# EAGLE design ledcube4x4x4_control (EAGLE 6.5.0)
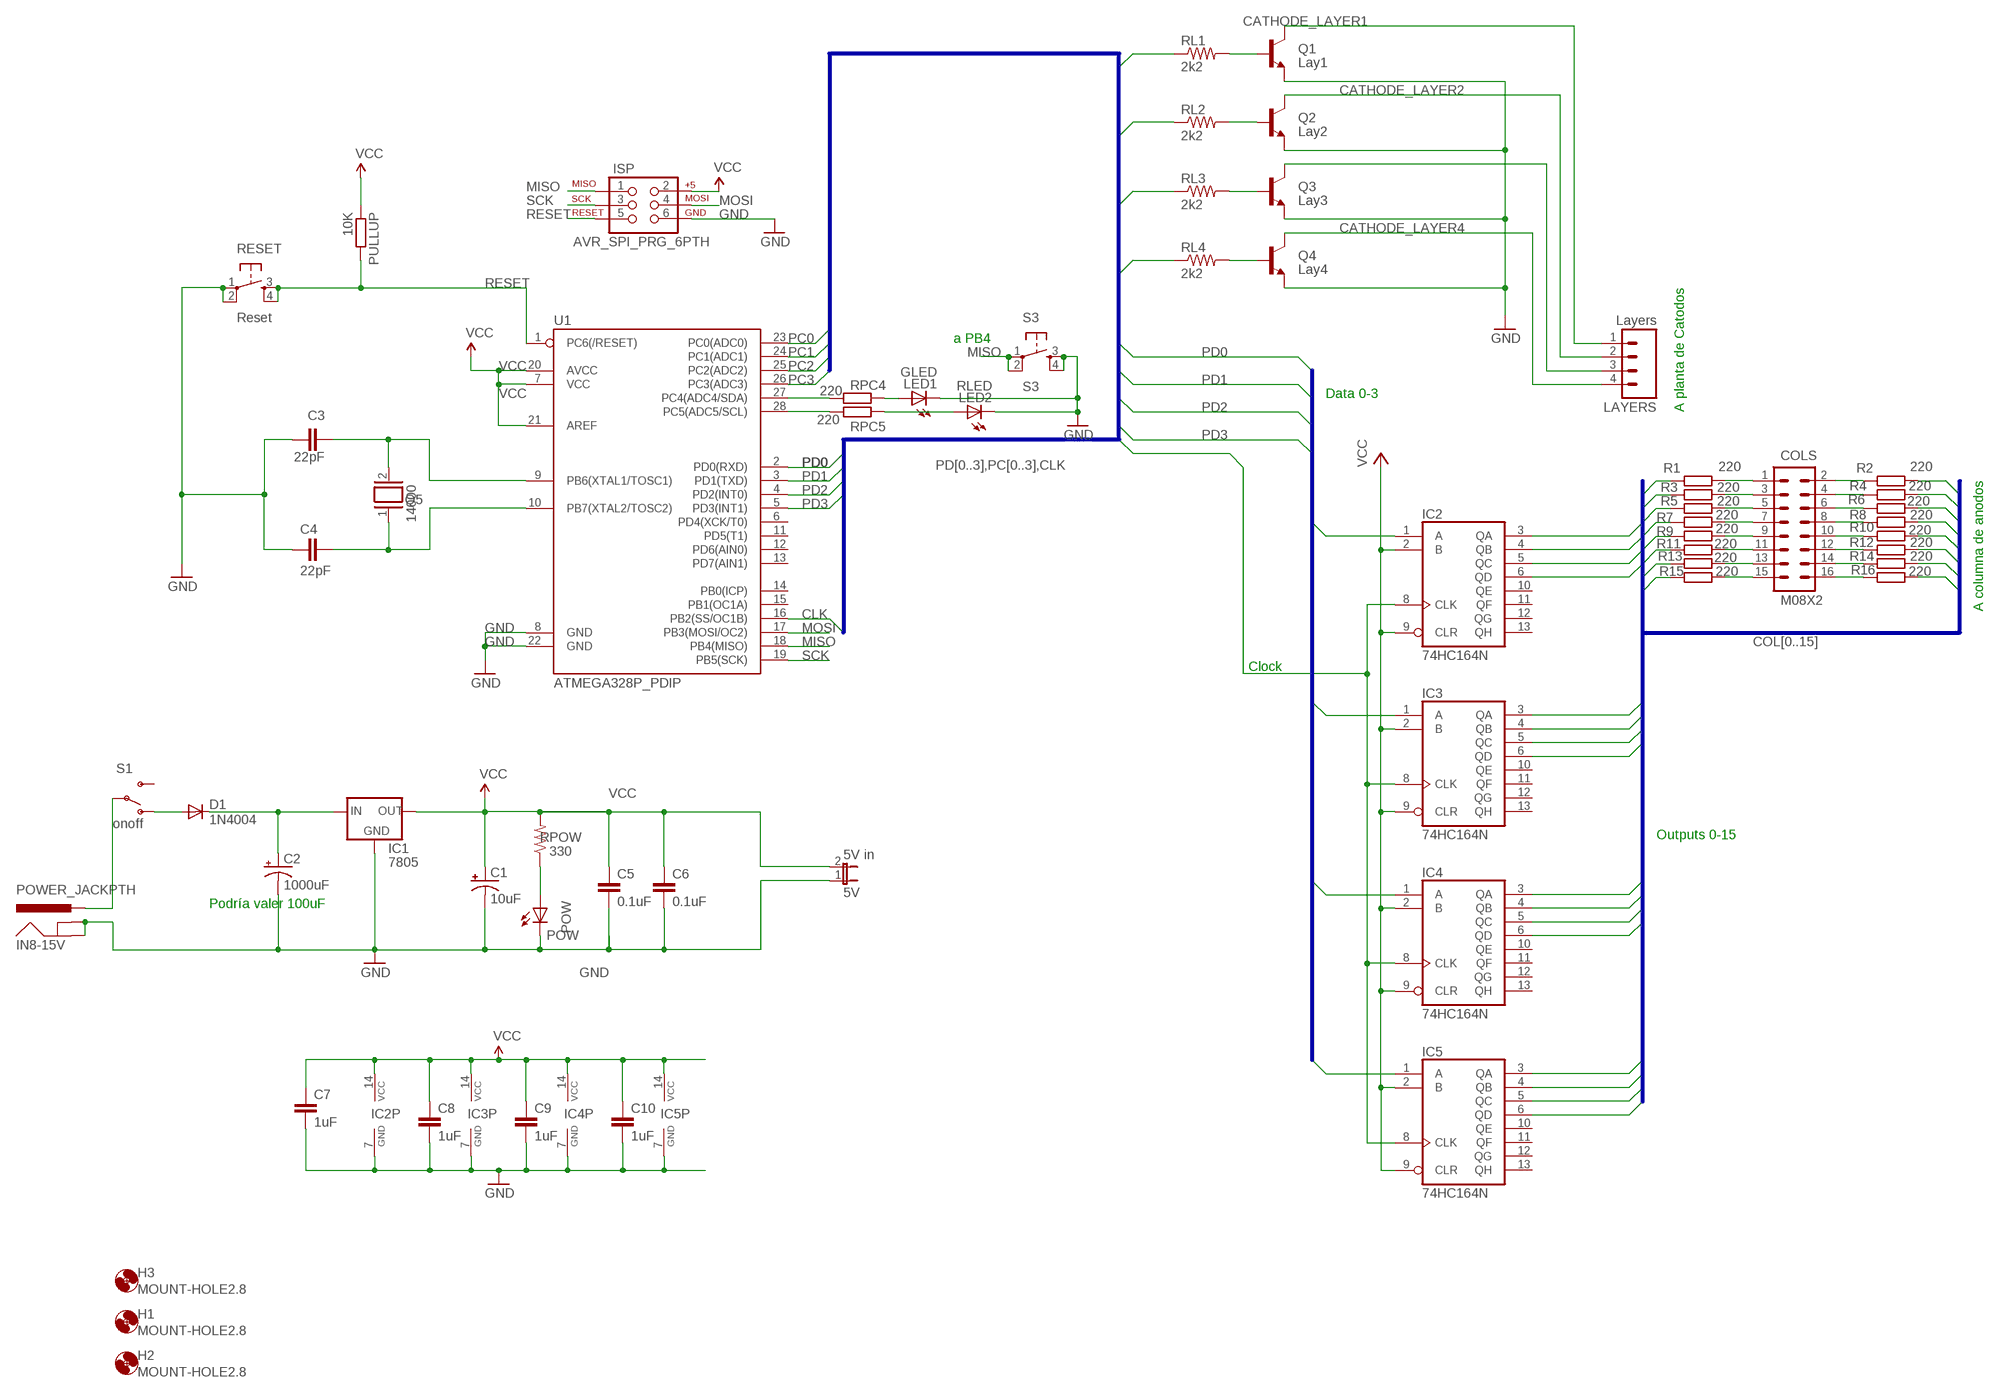
[diagram p0: schematic, sheet 1]

## Parts
5V  5V in  JP1E  [JP1]
C1  10uF  10UF-25V-20%(PTH)  [CPOL-RADIAL-10UF-25V]
C2  1000uF  CAP_POLPTH4  [CPOL-RADIAL-1000UF-25V]
C3  22pF  CAPEZ  [CAP-PTH-SMALLEZ]
C4  22pF  CAPEZ  [CAP-PTH-SMALLEZ]
C5  0.1uF  CAPKIT  [CAP-PTH-SMALL-KIT]
C6  0.1uF  CAPKIT  [CAP-PTH-SMALL-KIT]
C7  1uF  CAPKIT  [CAP-PTH-SMALL-KIT]
C8  1uF  CAPKIT  [CAP-PTH-SMALL-KIT]
C9  1uF  CAPKIT  [CAP-PTH-SMALL-KIT]
C10  1uF  CAPKIT  [CAP-PTH-SMALL-KIT]
COLS  M08X2  [2X8]
D1  1N4004  [DO41-10]
H1  MOUNT-HOLE2.8  [2,8]
H2  MOUNT-HOLE2.8  [2,8]
H3  MOUNT-HOLE2.8  [2,8]
IC1  7805  V_REG_78XXSINK  [TO220-IGO]
IC2  74HC164N  [DIL14]
IC3  74HC164N  [DIL14]
IC4  74HC164N  [DIL14]
IC5  74HC164N  [DIL14]
IN8-15V  POWER_JACKPTH  [POWER_JACK_PTH]
ISP  AVR_SPI_PRG_6PTH  [2X3]
LAYERS  Layers  M04PTH  [1X04]
LED1  GLED  LED5MM  [LED5MM]
LED2  RLED  LED5MM  [LED5MM]
POW  POW  LED3MM  [LED3MM]
PULLUP  10K  R-EU_0207/10  [0207/10]
Q1  Lay1  TRANSISTOR_NPNTO-92-AMMO  [TO-92-AMMO]
Q2  Lay2  TRANSISTOR_NPNTO-92-AMMO  [TO-92-AMMO]
Q3  Lay3  TRANSISTOR_NPNTO-92-AMMO  [TO-92-AMMO]
Q4  Lay4  TRANSISTOR_NPNTO-92-AMMO  [TO-92-AMMO]
Q5  14000  XTAL/S  [QS]
R1  220  R-EU_0207/10  [0207/10]
R2  220  R-EU_0207/10  [0207/10]
R3  220  R-EU_0207/10  [0207/10]
R4  220  R-EU_0207/10  [0207/10]
R5  220  R-EU_0207/10  [0207/10]
R6  220  R-EU_0207/10  [0207/10]
R7  220  R-EU_0207/10  [0207/10]
R8  220  R-EU_0207/10  [0207/10]
R9  220  R-EU_0207/10  [0207/10]
R10  220  R-EU_0207/10  [0207/10]
R11  220  R-EU_0207/10  [0207/10]
R12  220  R-EU_0207/10  [0207/10]
R13  220  R-EU_0207/10  [0207/10]
R14  220  R-EU_0207/10  [0207/10]
R15  220  R-EU_0207/10  [0207/10]
R16  220  R-EU_0207/10  [0207/10]
RESET  Reset  TAC_SWITCHPTH  [TACTILE-PTH]
RL1  2k2  RESISTORPTH-1/4W  [AXIAL-0.4]
RL2  2k2  RESISTORPTH-1/4W  [AXIAL-0.4]
RL3  2k2  RESISTORPTH-1/4W  [AXIAL-0.4]
RL4  2k2  RESISTORPTH-1/4W  [AXIAL-0.4]
RPC4  220  R-EU_0207/10  [0207/10]
RPC5  220  R-EU_0207/10  [0207/10]
RPOW  330  RESISTORPTH-1/4W  [AXIAL-0.4]
S1  onoff  SWITCH-SPDTPTH  [SWITCH-SPDT]
S3  S3  TAC_SWITCHPTH  [TACTILE-PTH]
U1  ATMEGA328P_PDIP  [DIL28-3]

## Nets
BASE_LAYER1: Q1.2(B) RL1.P$2
BASE_LAYER2: Q2.2(B) RL2.P$2
BASE_LAYER3: Q3.2(B) RL3.P$2
BASE_LAYER4: Q4.2(B) RL4.P$2
CATHODE_LAYER1: LAYERS.1 Q1.3(C)
CATHODE_LAYER2: LAYERS.2 Q2.3(C)
CATHODE_LAYER4: LAYERS.4 Q4.3(C)
CLK: IC2.8(CLK) IC3.8(CLK) IC4.8(CLK) IC5.8(CLK) U1.16(PB2(SS/OC1B))
COL0: IC2.3(QA) R1.1
COL1: IC2.4(QB) R2.2
COL2: IC2.5(QC) R3.1
COL3: IC2.6(QD) R4.2
COL4: IC3.3(QA) R5.1
COL5: IC3.4(QB) R6.2
COL6: IC3.5(QC) R7.1
COL7: IC3.6(QD) R8.2
COL8: IC4.3(QA) R9.1
COL9: IC4.4(QB) R10.2
COL10: IC4.5(QC) R11.1
COL11: IC4.6(QD) R12.2
COL12: IC5.3(QA) R13.1
COL13: IC5.4(QB) R14.2
COL14: IC5.5(QC) R15.1
COL15: IC5.6(QD) R16.2
GND: 5V.1 C1.2(-) C2.2(-) C3.2 C4.2 C5.2 C6.2 C7.2 C8.2 C9.2 C10.2 IC1.GND IC2.7(GND) IC3.7(GND) IC4.7(GND) IC5.7(GND) IN8-15V.GND IN8-15V.GNDBREAK ISP.6 LED1.K(C) LED2.K(C) POW.K(C) Q1.1(E) Q2.1(E) Q3.1(E) Q4.1(E) RESET.1 RESET.2 S3.3 S3.4 U1.8(GND) U1.22(GND)
MISO: ISP.1 S3.1 S3.2 U1.18(PB4(MISO))
MOSI: ISP.4 U1.17(PB3(MOSI/OC2))
N$1: IN8-15V.PWR S1.2(P)
N$2: C2.1(+) D1.C IC1.IN
N$3: LED2.A RPC5.2
N$4: LED1.A RPC4.2
N$5: RPC5.1 U1.28(PC5(ADC5/SCL))
N$7: RPC4.1 U1.27(PC4(ADC4/SDA))
N$9: COLS.1 R1.2
N$10: COLS.3 R3.2
N$11: LAYERS.3 Q3.3(C)
N$18: COLS.5 R5.2
N$19: C3.1 Q5.2 U1.9(PB6(XTAL1/TOSC1))
N$20: C4.1 Q5.1 U1.10(PB7(XTAL2/TOSC2))
N$21: COLS.7 R7.2
N$22: COLS.15 R15.2
N$23: COLS.13 R13.2
N$24: COLS.11 R11.2
N$25: COLS.9 R9.2
N$26: D1.A S1.1(O)
N$28: POW.A RPOW.P$1
N$36: COLS.2 R2.1
N$37: COLS.4 R4.1
N$38: COLS.6 R6.1
N$39: COLS.8 R8.1
N$40: COLS.10 R10.1
N$41: COLS.12 R12.1
N$42: COLS.14 R14.1
N$43: COLS.16 R16.1
PC0: RL1.P$1 U1.23(PC0(ADC0))
PC1: RL2.P$1 U1.24(PC1(ADC1))
PC2: RL3.P$1 U1.25(PC2(ADC2))
PC3: RL4.P$1 U1.26(PC3(ADC3))
PD0: IC2.1(A) U1.2(PD0(RXD))
PD1: IC3.1(A) U1.3(PD1(TXD))
PD2: IC4.1(A) U1.4(PD2(INT0))
PD3: IC5.1(A) U1.5(PD3(INT1))
RESET: ISP.5 PULLUP.2 RESET.3 RESET.4 U1.1(PC6(/RESET))
SCK: ISP.3 U1.19(PB5(SCK))
VCC [POWER]: 5V.2 C1.1(+) C5.1 C6.1 C7.1 C8.1 C9.1 C10.1 IC1.OUT IC2.2(B) IC2.9(CLR) IC2.14(VCC) IC3.2(B) IC3.9(CLR) IC3.14(VCC) IC4.2(B) IC4.9(CLR) IC4.14(VCC) IC5.2(B) IC5.9(CLR) IC5.14(VCC) ISP.2 PULLUP.1 RPOW.P$2 U1.7(VCC) U1.20(AVCC) U1.21(AREF)
Unconnected: IC2.10(QE) IC2.11(QF) IC2.12(QG) IC2.13(QH) IC3.10(QE) IC3.11(QF) IC3.12(QG) IC3.13(QH) IC4.10(QE) IC4.11(QF) IC4.12(QG) IC4.13(QH) IC5.10(QE) IC5.11(QF) IC5.12(QG) IC5.13(QH) S1.3(S) U1.6(PD4(XCK/T0)) U1.11(PD5(T1)) U1.12(PD6(AIN0)) U1.13(PD7(AIN1)) U1.14(PB0(ICP)) U1.15(PB1(OC1A))

## Buses
PD[0..3],PC[0..3],CLK
COL[0..15]
PD[0..3]

## Notes on the sheet
- a PB4
- Data 0-3
- A planta de Catodos
- A columna de anodos
- Clock
- Outputs 0-15
- Podría valer 100uF

## Library data of the parts
5V = jumper:JP1E: JUMPER; MF: TE CONNECTIVITY; MPN: 1-881545-1; OC_FARNELL: 1822174
C1 = SparkFun-Capacitors:10UF-25V-20%(PTH): CAP-08440; MF: RUBYCON; MPN: 100PK10MEFC5X11; OC_FARNELL: 2346533; PROD_ID: CAP-08440
C2 = SparkFun-Capacitors:CAP_POL: Capacitor Polarized These are standard SMD and PTH capacitors. Normally 10uF, 47uF, and 100uF in electrolytic and tantalum varieties. Always verify the external diameter of the through hole cap, it varies with capacity, voltage, and manufacturer. The EIA devices should be standard.; MF: RUBYCON; MPN: 35YXJ1000M12.5X20; OC_FARNELL: 2346262
C3-C10 = SparkFun-Capacitors:CAP: Capacitor Standard 0603 ceramic capacitor, and 0.1" leaded capacitor.; OC_FARNELL: unknown
COLS = SparkFun-Connectors:M08X2: .1" headers, two rows of 8 each; OC_FARNELL: unknown
D1 = diode:1N4004: DIODE general purpose rectifier, 1 A; MF: MICRO COMMERCIAL COMPONENTS; MPN: 1N4004-TP; OC_FARNELL: 1924514
H1-H3 = holes:MOUNT-HOLE: MOUNTING HOLE with drill center marker; OC_FARNELL: unknown
IC1 = SparkFun-PowerIC:V_REG_78XX: Voltage Regulator Standard 7805 5V regulator. IGO (Input Ground Output). Spark Fun Electronics SKU : COM-00107; MF: STMICROELECTRONICS; MPN: L7805ABV; OC_FARNELL: 1467758
IC2-IC5 = 74xx-eu:74*164: 8-bit parallel out SHIFT REGISTER; MF: TEXAS INSTRUMENTS; MPN: SN74HC164N; OC_FARNELL: 1287514
IN8-15V = SparkFun-Connectors:POWER_JACK: Power Jack This is the standard 5.5mm barrel jack for power. The PTH is the most common, proven, reliable, footprint. The Slot footprint only works if the mill layer is transmitted to the PCB fab house so be warned. Mating wall wart : TOL-00298 (and others); OC_FARNELL: unknown; PROD_ID: PRT-00119
ISP = SparkFun-Connectors:AVR_SPI_PRG_6: AVR ISP 6 Pin This is the reduced ISP connector for AVR programming. Common on Arduino. This footprint will take up less PCB space and can be used with a 10-pin to 6-pin adapter such as SKU: BOB-08508; OC_FARNELL: unknown
LAYERS = SparkFun-Connectors:M04: Header 4 Standard 4-pin 0.1" header. Use with straight break away headers (SKU : PRT-00116), right angle break away headers (PRT-00553), swiss pins (PRT-00743), machine pins (PRT-00117), and female headers (PRT-00115). Molex polarized connector foot print use with SKU : PRT-08231 with associated crimp pins and housings. 1MM SMD Version SKU: PRT-10208; OC_FARNELL: unknown
LED1 LED2 POW = SparkFun-LED:LED: LEDs Standard schematic elements and footprints for 5mm, 3mm, 1206, and 0603 sized LEDs. 5mm - Spark Fun Electronics SKU : COM-00529 (and others); OC_FARNELL: unknown
PULLUP R1-R16 RPC4 RPC5 = rcl:R-EU_: RESISTOR, European symbol; OC_FARNELL: unknown
Q1-Q4 = SparkFun-DiscreteSemi:TRANSISTOR_NPN: Generic NPN BJT MMBT2222A - TRANS-08049 (SOT-23, 1A 40V) MPSA42 - TRANS-09116 (SOT-23, 500mA 300V) MMBT5088LT1G - TRANS-11160 (SOT-23, 50 mA 30V); OC_FARNELL: unknown
Q5 = special:XTAL/S: CRYSTAL; OC_FARNELL: unknown
RESET S3 = SparkFun-Electromechanical:TAC_SWITCH: Momentary Switch Button commonly used for reset or general input. Spark Fun Electronics SKU : COM-00097 SMT- SWCH-08247; OC_FARNELL: unknown
RL1-RL4 = SparkFun-Passives:RESISTOR: Resistor Basic schematic elements and footprints for 0603, 1206, and PTH resistors.; OC_FARNELL: unknown
RPOW = SparkFun-Resistors:RESISTOR: Resistor Basic schematic elements and footprints for 0603, 1206, and PTH resistors.; OC_FARNELL: unknown
S1 = SparkFun-Electromechanical:SWITCH-SPDT: SPDT Switch Simple slide switch, Spark Fun Electronics SKU : COM-00102 DPDT SMT slide switch, AYZ0202, SWCH-08179; OC_FARNELL: unknown
U1 = SparkFun-DigitalIC:ATMEGA328P_PDIP: uC used in the Arduino 32kb flash, 1k EEPROM, 2k SRAM This is the through-hole version of this chip.; MF: ATMEL; MPN: ATMEGA328P-PU; OC_FARNELL: 1715487

## Net classes
0 default: width 0.254 mm, drill 0.254 mm, clearance 0.203 mm
1 POWER: width 0.61 mm, drill 0.61 mm, clearance 0.254 mm
2 GND: width 0.61 mm, drill 0.61 mm, clearance 0.203 mm

## Board
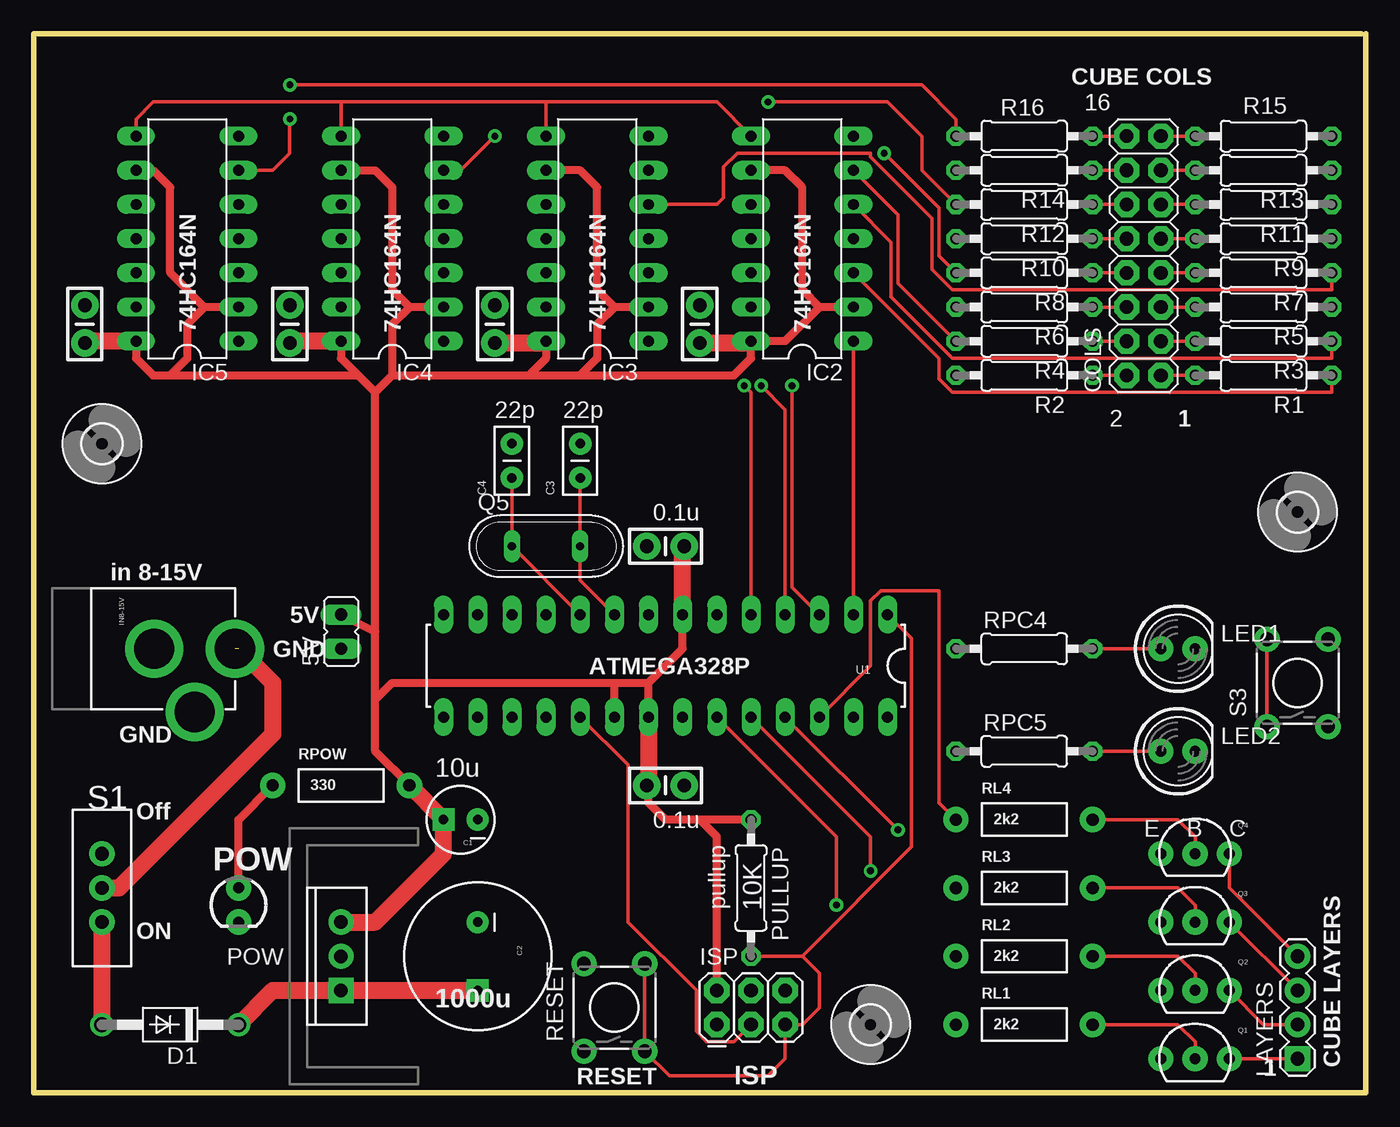
[diagram p1: board, top side]
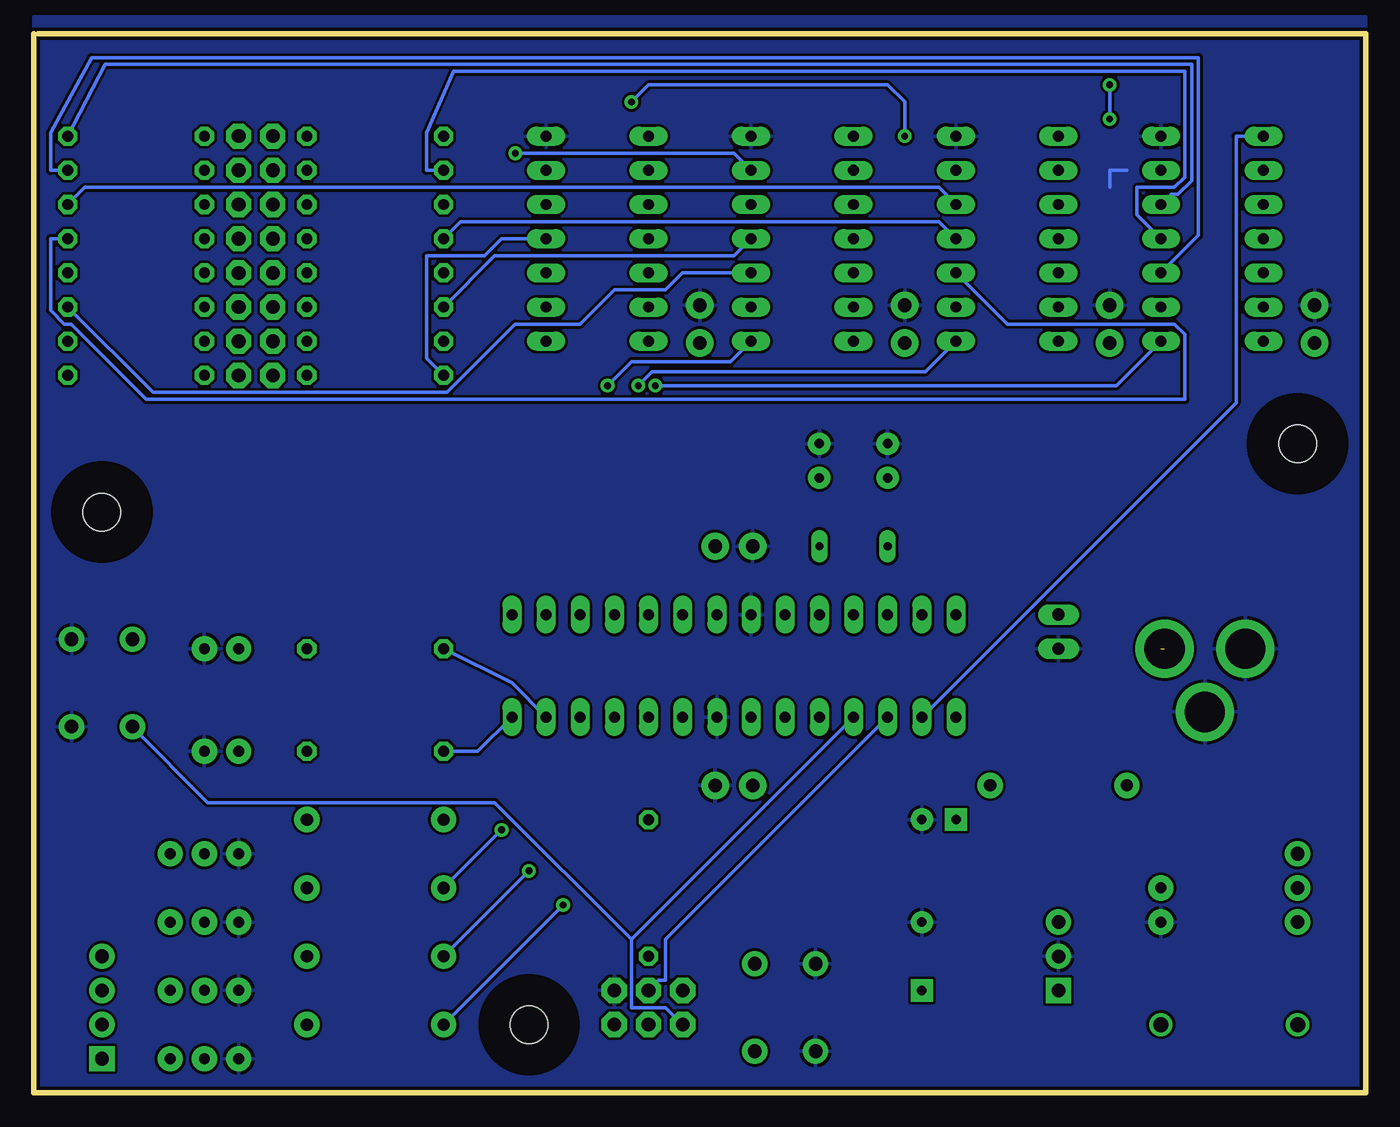
[diagram p2: board, bottom side, seen from below]

Size 99.06 x 78.74 mm. Coordinates in mm from the lower left corner, seen from the top.
Outline: 98.73,78.73 0,78.73 0,0 99.06,0 99.06,78.74
Copper layers (1*16): Top 0.035mm / dielectric 1.5mm / Bottom 0.035mm
Design rules "SparkFun *": minimum track width 8mil, minimum drill 20mil, track to track 8mil, track to pad 8mil, pad to pad 8mil, via to via 8mil, smd to smd 8mil, copper to edge 10mil, drill to drill 8mil, minimum pad ring 12mil, minimum via ring 10mil, stop-mask expansion 4mil, vias tented up to drill 25mil, thermal gap 10mil

### Footprints (pad centres in the part's own frame; a part is rotated, then mirrored left to right if it is on the bottom)
JP1 = drill 0.914 long: 1 0,-1.27; 2 0,1.27
CPOL-RADIAL-10UF-25V = drill 0.7 pad 1.651 square: 1 1.27,0 | drill 0.7 pad 1.651: 2 -1.27,0
CPOL-RADIAL-1000UF-25V = drill 0.7 pad 1.651 square: 1 2.54,0 | drill 0.7 pad 1.651: 2 -2.54,0
CAP-PTH-SMALLEZ = drill 0.7 pad 1.651: 1 0,0; 2 2.54,0
CAP-PTH-SMALL-KIT = drill 1.016 pad 2.032: 1 -1.397,0; 2 1.397,0
2X8 = drill 1.016 pad 1.88 octagon: 1 0,0; 2 0,2.54; 3 2.54,0; 4 2.54,2.54; 5 5.08,0; 6 5.08,2.54; 7 7.62,0; 8 7.62,2.54; 9 10.16,0; 10 10.16,2.54; 11 12.7,0; 12 12.7,2.54; 13 15.24,0; 14 15.24,2.54; 15 17.78,0; 16 17.78,2.54
DO41-10 = drill 1.118: A 5.08,0; C -5.08,0
2,8 = hole 2.8: 0,0
TO220-IGO = drill 1 pad 1.88: GND 0,0; OUT 2.54,0 | drill 1 pad 1.88 square: IN -2.54,0
DIL14 = drill 0.813 long: 1 -7.62,-3.81; 2 -5.08,-3.81; 3 -2.54,-3.81; 4 0,-3.81; 5 2.54,-3.81; 6 5.08,-3.81; 7 7.62,-3.81; 8 7.62,3.81; 9 5.08,3.81; 10 2.54,3.81; 11 0,3.81; 12 -2.54,3.81; 13 -5.08,3.81; 14 -7.62,3.81
POWER_JACK_PTH = drill 2.997 pad 4.318: GND 0,7.7; GNDBREAK 4.7,10.7; PWR 0,13.7
2X3 = drill 1.016 pad 1.88 octagon: 1 0,0; 2 0,2.54; 3 2.54,0; 4 2.54,2.54; 5 5.08,0; 6 5.08,2.54
1X04 = drill 1.016 pad 1.88 square: 1 0,0 | drill 1.016 pad 1.88: 2 2.54,0; 3 5.08,0; 4 7.62,0
LED5MM = drill 0.813 pad 1.88: A -1.27,0; K 1.27,0
LED3MM = drill 0.813 pad 1.88: A -1.27,0; K 1.27,0
0207/10 = drill 0.813 octagon: 1 -5.08,0; 2 5.08,0
TO-92-AMMO = drill 0.813 pad 1.88: 1 -2.54,0; 2 0,0; 3 2.54,0
QS = drill 0.61 long: 1 -2.54,0; 2 2.54,0
TACTILE-PTH = drill 1.016 pad 1.88: 1 -3.251,2.261; 2 3.251,2.261; 3 -3.251,-2.261; 4 3.251,-2.261
AXIAL-0.4 = drill 0.9 pad 1.88: P$1 -5.08,0; P$2 5.08,0
SWITCH-SPDT = drill 1.016 pad 1.88: 1 0,2.54; 2 0,0; 3 0,-2.54
DIL28-3 = drill 0.813 long: 1 -16.51,-3.81; 2 -13.97,-3.81; 3 -11.43,-3.81; 4 -8.89,-3.81; 5 -6.35,-3.81; 6 -3.81,-3.81; 7 -1.27,-3.81; 8 1.27,-3.81; 9 3.81,-3.81; 10 6.35,-3.81; 11 8.89,-3.81; 12 11.43,-3.81; 13 13.97,-3.81; 14 16.51,-3.81; 15 16.51,3.81; 16 13.97,3.81; 17 11.43,3.81; 18 8.89,3.81; 19 6.35,3.81; 20 3.81,3.81; 21 1.27,3.81; 22 -1.27,3.81; 23 -3.81,3.81; 24 -6.35,3.81; 25 -8.89,3.81; 26 -11.43,3.81; 27 -13.97,3.81; 28 -16.51,3.81

### Placement (x,y rotation side)
5V  22.86,34.29 0 top
C1  31.75,20.32 180 top
C2  33.02,10.16 270 top
C3  40.64,45.72 90 top
C4  35.56,45.72 90 top
C5  46.99,22.86 0 top
C6  34.29,57.15 90 top
C7  3.81,57.15 90 top
C8  19.05,57.15 90 top
C9  46.99,40.64 180 top
C10  49.53,57.15 90 top
COLS  83.82,53.34 90 top
D1  10.16,5.08 180 top
H1  93.98,43.18 0 top
H2  62.23,5.08 0 top
H3  5.08,48.26 0 top
IC1  22.86,10.16 90 top
IC2  57.15,63.5 90 top
IC3  41.91,63.5 90 top
IC4  26.67,63.5 90 top
IC5  11.43,63.5 90 top
IN8-15V  1.27,33.02 270 top
ISP  50.8,5.08 0 top
LAYERS  93.98,2.54 90 top
LED1  85.09,33.02 0 top
LED2  85.09,25.4 0 top
POW  15.24,13.97 270 top
PULLUP  53.34,15.24 270 top
Q1  86.36,2.54 0 top
Q2  86.36,7.62 0 top
Q3  86.36,12.7 0 top
Q4  86.36,17.78 0 top
Q5  38.1,40.64 0 top
R1  91.44,53.34 180 top
R2  73.66,53.34 180 top
R3  91.44,55.88 180 top
R4  73.66,55.88 180 top
R5  91.44,58.42 180 top
R6  73.66,58.42 180 top
R7  91.44,60.96 180 top
R8  73.66,60.96 180 top
R9  91.44,63.5 180 top
R10  73.66,63.5 180 top
R11  91.44,66.04 180 top
R12  73.66,66.04 180 top
R13  91.44,68.58 180 top
R14  73.66,68.58 180 top
R15  91.44,71.12 180 top
R16  73.66,71.12 180 top
RESET  43.18,6.35 90 top
RL1  73.66,5.08 0 top
RL2  73.66,10.16 0 top
RL3  73.66,15.24 0 top
RL4  73.66,20.32 0 top
RPC4  73.66,33.02 0 top
RPC5  73.66,25.4 0 top
RPOW  22.86,22.86 0 top
S1  5.08,15.24 180 top
S3  93.98,30.48 90 top
U1  46.99,31.75 180 top

### Tracks (layer width: path | path; a pad name or v marks a point on that pad's centre or on a via)
BASE_LAYER1
  Top 0.254: RL1.P$2 85.09,5.08 86.36,3.81 Q1.2
BASE_LAYER2
  Top 0.254: RL2.P$2 85.09,10.16 86.36,8.89 Q2.2
BASE_LAYER3
  Top 0.254: RL3.P$2 85.09,15.24 86.36,13.97 Q3.2
BASE_LAYER4
  Top 0.254: RL4.P$2 85.09,20.32 86.36,19.05 Q4.2
CATHODE_LAYER1
  Top 0.254: LAYERS.1 Q1.3
CATHODE_LAYER2
  Top 0.254: Q2.3 91.44,5.08 LAYERS.2
CATHODE_LAYER4
  Top 0.254: LAYERS.4 88.9,15.24 Q4.3
CLK
  Top 0.254: IC5.8 7.62,72.39 8.89,73.66 22.86,73.66 | 22.86,73.66 38.1,73.66 | 38.1,73.66 50.8,73.66 IC2.8 | IC3.8 38.1,73.66 | IC4.8 22.86,73.66
  Bottom 0.254: U1.16 9.65,51.31 9.65,71.12 IC5.8
COL0
  Top 0.254: IC2.3 67.31,54.61 67.31,53.09 68.33,52.07 96.52,52.07 R1.1
COL1
  Bottom 0.254: R2.2 69.85,54.61 69.85,62.23 65.53,62.23 64.26,63.5 IC2.4
COL2
  Top 0.254: IC2.5 63.75,63.25 63.75,59.18 68.33,54.61 96.52,54.61 R3.1
COL3
  Top 0.254: R4.2 64.26,60.2 64.26,65.28 IC2.6
COL4
  Bottom 0.254: R5.1 90.17,52.07 68.33,52.07 63.25,57.15 58.42,57.15 55.88,59.69 52.07,59.69 50.8,60.96 IC3.3
COL5
  Bottom 0.254: IC3.4 46.99,62.23 64.77,62.23 R6.2
COL6
  Top 0.254: R7.1 96.52,59.69 68.33,59.69 66.8,61.21 66.8,65.02 62.23,69.6 62.23,69.85 52.32,69.85 51.31,68.83 51.31,66.55 50.8,66.04 IC3.5
COL7  (via drill 0.51)
  Top 0.254: v63.25,69.85 67.31,65.79 67.31,62.23 R8.2
  Bottom 0.254: IC3.6 46.99,69.85 v63.25,69.85
COL8
  Bottom 0.254: IC4.3 26.67,57.15 14.22,57.15 13.46,56.39 13.46,51.56 90.68,51.56 96.27,57.15 96.77,57.15 97.79,58.17 97.79,63.5 R9.1
COL9
  Bottom 0.254: IC4.4 31.75,64.77 67.31,64.77 R10.2
COL10
  Bottom 0.254: IC4.5 31.75,67.31 95.25,67.31 R11.1
COL11  (via drill 0.51)
  Top 0.254: IC4.6 31.75,68.58 v34.29,71.12 | R12.2 66.04,68.58 66.04,71.12 63.5,73.66 v54.61,73.66
  Bottom 0.254: v34.29,71.12 34.29,73.66 35.56,74.93 53.34,74.93 v54.61,73.66
COL12
  Bottom 0.254: IC5.3 12.45,63.75 12.45,76.96 94.74,76.96 97.79,71.37 97.79,68.58 R13.1
COL13
  Bottom 0.254: IC5.4 17.02,65.28 17.02,67.31 14.22,67.31 13.46,68.07 13.46,75.95 67.82,75.95 69.85,71.37 69.85,68.58 R14.2
COL14
  Bottom 0.254: IC5.5 14.48,66.8 13.97,66.8 12.95,67.82 12.95,76.45 93.73,76.45 R15.1
COL15  (via drill 0.51)
  Top 0.254: IC5.6 17.78,68.58 19.05,69.85 v19.05,72.39 | v19.05,74.93 66.04,74.93 68.58,72.39 R16.2
  Bottom 0.254: v19.05,72.39 v19.05,74.93
GND
  Bottom 0.254: 19.05,67.31 19.05,68.58 17.78,68.58
  pour Bottom (isolate 0.203): 0,0 0,80.01 99.06,80.01 99.06,0
MISO
  Top 0.254: S3.1 91.69,27.43 91.69,33.53 S3.2
  Bottom 0.254: 54.61,11.43 U1.18 | ISP.1 52.07,6.35 54.61,6.35 54.61,11.43 | 54.61,11.43 64.77,21.59 86.11,21.59 91.69,27.18 S3.1
MOSI
  Bottom 0.254: U1.17 52.07,11.43 52.07,8.38 52.58,8.38 ISP.4
N$1  (1 unrouted)
  Top 1.27: 15.24,33.02 17.78,30.48 17.78,26.67 6.35,15.24 S1.2
N$2
  Top 0.813: IC1.IN 22.96,7.62
  Top 1.27: D1.C 17.78,7.62 IC1.IN | 22.96,7.62 C2.1
N$3
  Top 0.254: LED2.A RPC5.2
N$4
  Top 0.254: LED1.A RPC4.2
N$5
  Bottom 0.254: U1.28 66.04,25.4 RPC5.1
N$7
  Bottom 0.254: U1.27 63.5,30.48 RPC4.1
N$9
  Top 0.254: COLS.1 R1.2
N$10
  Top 0.254: COLS.3 R3.2
N$11
  Top 0.254: Q3.3 LAYERS.3
N$18
  Top 0.254: COLS.5 R5.2
N$19
  Top 0.254: C3.1 Q5.2 40.64,38.1 U1.9
N$20
  Top 0.254: C4.1 Q5.1 U1.10
N$21
  Top 0.254: COLS.7 R7.2
N$22
  Top 0.254: COLS.15 R15.2
N$23
  Top 0.254: COLS.13 R13.2
N$24
  Top 0.254: COLS.11 R11.2
N$25
  Top 0.254: COLS.9 R9.2
N$26
  Top 1.27: S1.1 D1.A
N$28
  Top 0.61: POW.A 15.24,20.32 RPOW.P$1
N$36
  Top 0.254: COLS.2 R2.1
N$37
  Top 0.254: COLS.4 R4.1
N$38
  Top 0.254: COLS.6 R6.1
N$39
  Top 0.254: COLS.8 R8.1
N$40
  Top 0.254: COLS.10 R10.1
N$41
  Top 0.254: COLS.12 R12.1
N$42
  Top 0.254: COLS.14 R14.1
N$43
  Top 0.254: COLS.16 R16.1
PC0  (via drill 0.51)
  Top 0.254: U1.23 59.69,19.05 v59.69,13.97
  Bottom 0.254: RL1.P$1 v59.69,13.97
PC1  (via drill 0.51)
  Top 0.254: U1.24 62.23,19.05 v62.23,16.51
  Bottom 0.254: RL2.P$1 v62.23,16.51
PC2  (via drill 0.51)
  Top 0.254: v64.26,19.56 U1.25
  Bottom 0.254: RL3.P$1 v64.26,19.56
PC3
  Top 0.254: U1.26 62.23,31.75 62.23,36.58 62.99,37.34 67.31,37.34 67.31,21.59 RL4.P$1
PD0
  Top 0.254: IC2.1 U1.2
PD1  (via drill 0.51)
  Top 0.254: U1.3 56.39,37.59 v56.39,52.58
  Bottom 0.254: v56.39,52.58 54.61,54.36 47.24,54.36 IC3.1
PD2  (via drill 0.51)
  Top 0.254: v54.1,52.58 55.88,50.8 U1.4
  Bottom 0.254: IC4.1 32.77,53.59 53.09,53.59 v54.1,52.58
PD3  (via drill 0.51)
  Top 0.254: v52.83,52.58 53.34,52.07 U1.5
  Bottom 0.254: IC5.1 18.54,52.58 v52.83,52.58
RESET
  Top 0.254: RESET.4 RESET.3 47.27,1.27 54.61,1.27 55.88,2.54 ISP.5 57.15,5.08 58.42,6.35 58.42,8.89 57.15,10.16 | PULLUP.2 57.15,10.16 | U1.1 65.28,33.78 65.28,18.29 57.15,10.16
SCK
  Top 0.254: U1.19 44.2,24.38 44.2,12.7 49.28,7.62 49.28,4.57 50.04,3.81 52.07,3.81 ISP.3
VCC
  Top 0.61: 43.18,30.48 26.67,30.48 25.4,29.21 | 43.18,30.48 45.72,30.48 | 45.72,30.48 48.26,33.02 U1.7 | RPOW.P$2 25.4,25.4 25.4,29.21 | 25.4,29.21 25.4,34.29 | 25.4,34.29 25.4,52.07 | 5V.2 25.4,34.29 | 25.4,52.07 24.13,53.34 | 26.67,53.34 25.4,52.07 | IC5.14 7.62,54.61 8.89,53.34 10.16,53.34 | 10.16,53.34 24.13,53.34 | 26.67,53.34 36.83,53.34 | 36.83,53.34 40.64,53.34 | 40.64,53.34 52.07,53.34 53.34,54.61 IC2.14 | 3.94,55.88 C7.1 | 19.18,55.88 C8.1 | 53.21,55.75 IC2.14 | IC4.14 22.86,54.61 24.13,53.34 | 36.83,53.34 38.1,54.61 IC3.14 arc-90 37.97,55.75 | IC5.2 12.7,58.42 | 12.7,58.42 11.43,57.15 11.43,54.61 10.16,53.34 | IC4.2 27.94,58.42 | 27.94,58.42 26.67,57.15 26.67,53.34 | IC3.2 43.18,58.42 | 43.18,58.42 41.91,57.15 41.91,54.61 40.64,53.34 | IC2.2 58.42,58.42 | 58.42,58.42 55.88,55.88 IC2.14 | 48.26,40.51 C9.1 | U1.20 43.18,30.48 | U1.21 45.72,30.48 | PULLUP.1 49.53,20.32 | 49.53,20.32 46.99,20.32 45.72,21.59 45.72,22.73 45.97,22.86 C5.1 45.72,22.86 45.72,22.99 | IC5.9 8.89,68.58 10.16,67.31 10.16,60.96 12.7,58.42 | IC4.9 25.4,68.58 26.67,67.31 26.67,59.69 27.94,58.42 | 43.18,58.42 41.91,59.69 41.91,67.31 40.64,68.58 IC3.9 | 58.42,58.42 57.15,59.69 57.15,67.31 55.88,68.58 IC2.9 | ISP.2 50.8,19.05 49.53,20.32
  Top 1.27: IC1.OUT 25.4,12.7 30.48,17.78 C1.1 RPOW.P$2 | IC5.14 3.94,55.88 | IC4.14 19.18,55.88 | C10.1 53.21,55.75 | C6.1 37.97,55.75 | U1.7 48.26,40.51 | U1.21 45.72,22.99

### Text on the board
tPlace: CUBE COLS | 16 | 74HC164N | 74HC164N | 74HC164N | 74HC164N | 22p | 22p | 2 | 1 | 0.1u | in 8-15V | 5V | GND | ATMEGA328P | GND | 10u | 0.1u | Off | E | B | C | pullup | POW | 10K | ON | 1000u | RESET | CUBE LAYERS | ISP | 1
_tNames: POW